# Altium schematic sheet DIGITAL POT.SchDoc
size A; SheetNumber: 17; SheetTotal: 24
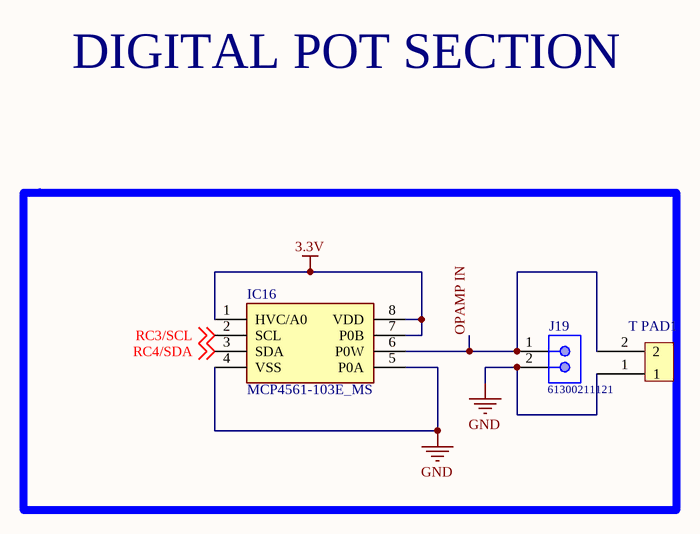
[diagram p0: DIGITAL POT.SchDoc]

## Parts
IC16  MCP4561-103E_MS  [SOP65P490X110-8N]
J19  61300211121  [61300211121]
T_PAD1  pad  [pad]  (value not drawn)

## Nets
3.3V: IC16.1(HVC/A0) IC16.7(P0B) IC16.8(VDD)
GND: IC16.4(VSS) IC16.5(P0A) J19.2 T_PAD1.1
OPAMP IN: IC16.6(P0W) J19.1 T_PAD1.2
RC3/SCL: IC16.2(SCL) ; off-sheet RC3/SCL
RC4/SDA: IC16.3(SDA) ; off-sheet RC4/SDA

## Notes on the sheet
- DIGITAL POT SECTION

## Library data of the parts
IC16 = MCP4561-103E_MS: Integrated Circuit; Manufacturer_Name: Microchip; Manufacturer_Part_Number: MCP4561-103E/MS; Datasheet Link: http://ww1.microchip.com/downloads/en/DeviceDoc/22107B.pdf; Height: 1.1mm; Mouser Part Number: 579-MCP4561-103E/MS; Mouser Price/Stock: https://www.mouser.co.uk/ProductDetail/Microchip-Technology/MCP4561-103E-MS?qs=hH%252BOa0VZEiBcchYhgnCL5Q%3D%3D; Arrow Part Number: MCP4561-103E/MS; Arrow Price/Stock: https://www.arrow.com/en/products/mcp4561-103ems/microchip-technology?region=nac
J19 = 61300211121: WR-PHD Pin Header, THT, pitch 2.54mm, Single Row, Vertical, 2pin; Pin Number: 2; Gender: Male; Rated Current: 3A; Working Voltage: 250VAC; Withstanding Voltage: 500VAC; Contact Resistance: 20mOhm; ComponentLink1Description: Manufacturer; ComponentLink1URL: http://www.we-online.de; ComponentLink2Description: Datasheet; ComponentLink2URL: https://katalog.we-online.de/em/datasheet/6130xx11121.pdf; Part Number: 61300211121; Published Date: June 2019; Publisher: Wurth Elektronik; Pitch: 2.54mm; Operating Temperature: -40 to +105degC; Mounting Technology: THT; Packaging: Bag; Row Number: Single; Orientation: Vertical